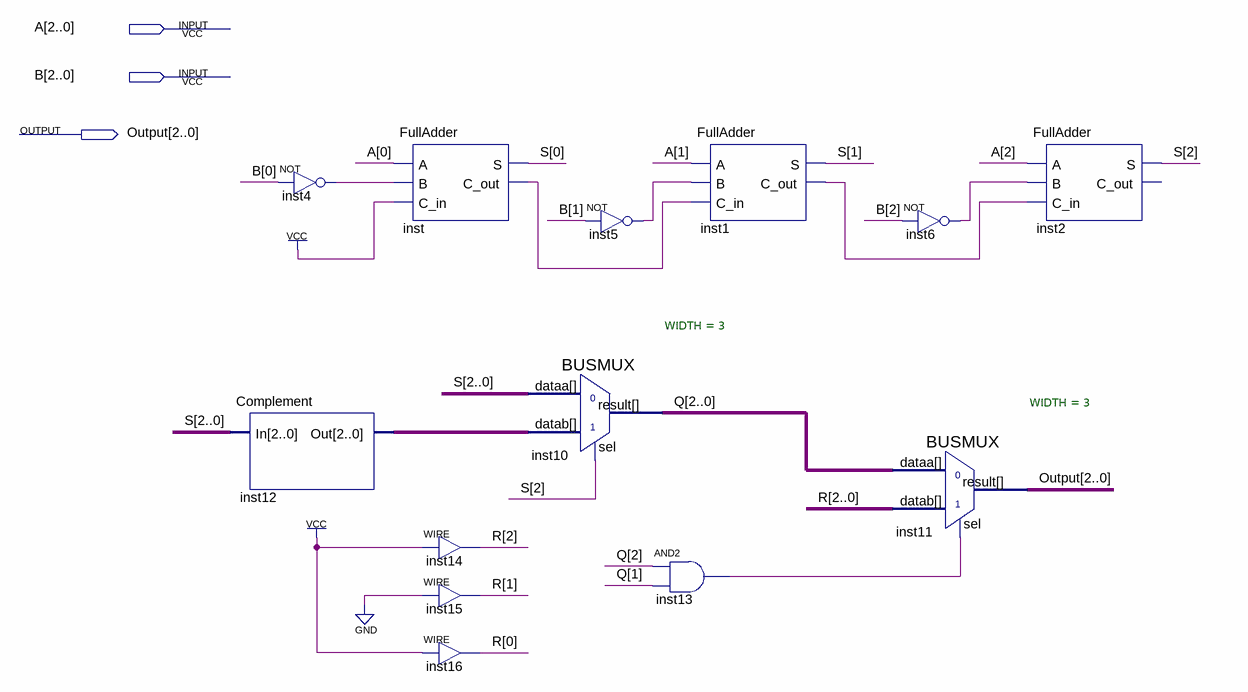
[diagram p0: schematic sheet]
// Quartus schematic Subtractor.bdf as structural Verilog: 13 symbols, 3 pins
module Subtractor (
  input  [2:0] A,
  input  [2:0] B,
  output [2:0] Output
);

  wire inst1_c_out, inst4_out, inst5_out, inst6_out, inst13_out, inst_c_out;
  wire [2:0] inst12_out, Q, R, S;

  not inst4 (inst4_out, B[0]);
  Complement inst12 (.In(S), .Out(inst12_out));
  FullAdder inst (.A(A[0]), .B(inst4_out), .C_in(1'b1), .S(S[0]), .C_out(inst_c_out));
  assign R[2] = 1'b1;  // WIRE inst14
  assign R[1] = 1'b0;  // WIRE inst15
  assign R[0] = 1'b1;  // WIRE inst16
  BUSMUX #(.WIDTH(3)) inst10 (.datab(inst12_out), .sel(S[2]), .dataa(S), .result(Q));
  not inst5 (inst5_out, B[1]);
  and inst13 (inst13_out, Q[2], Q[1]);
  FullAdder inst1 (.A(A[1]), .B(inst5_out), .C_in(inst_c_out), .S(S[1]), .C_out(inst1_c_out));
  not inst6 (inst6_out, B[2]);
  BUSMUX #(.WIDTH(3)) inst11 (.datab(R), .sel(inst13_out), .dataa(Q), .result(Output));
  FullAdder inst2 (.A(A[2]), .B(inst6_out), .C_in(inst1_c_out), .S(S[2]));  // open: C_out
endmodule
